# EAGLE design hat (EAGLE 7.5.0)
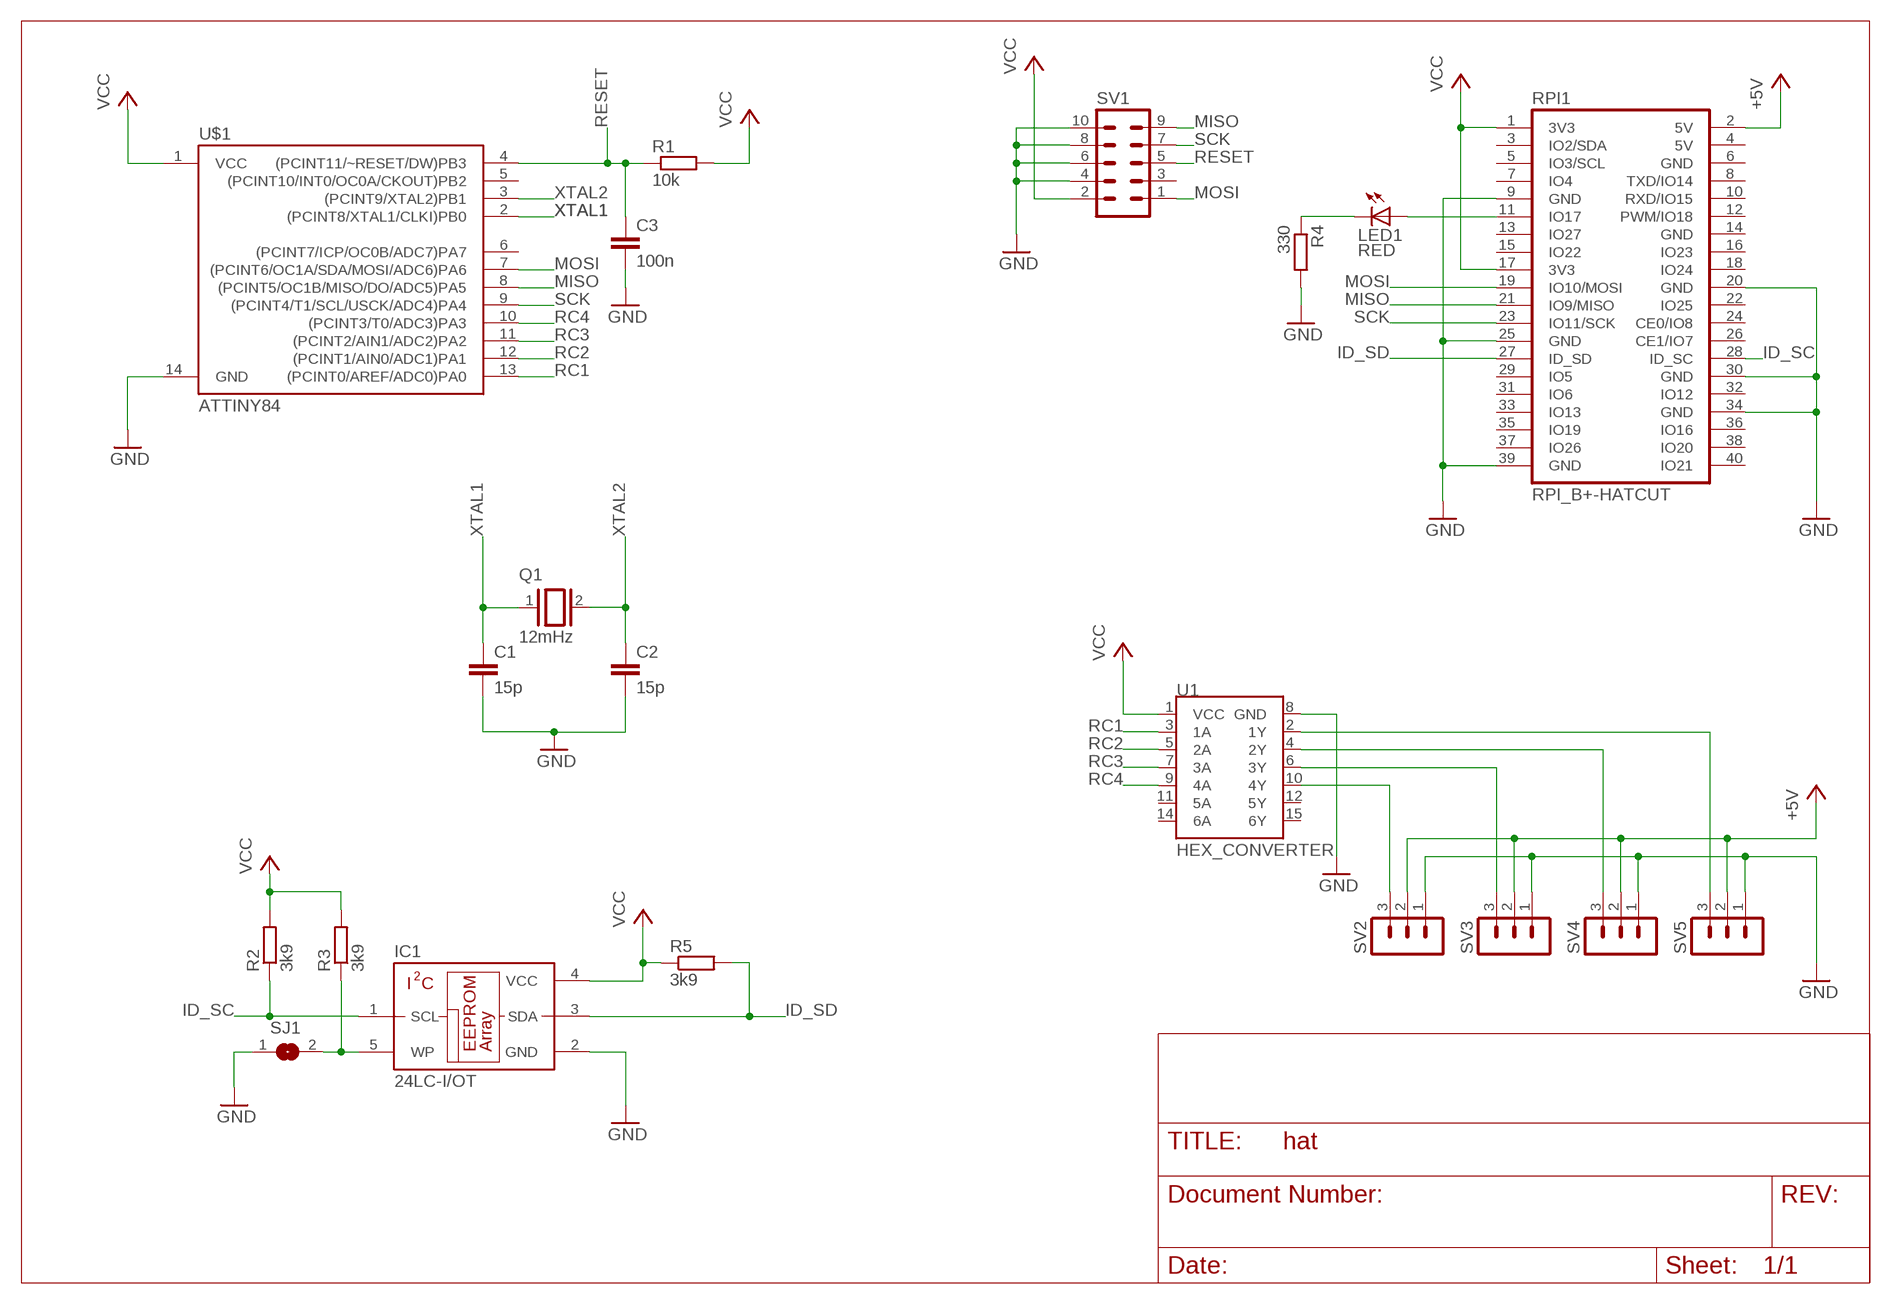
[diagram p0: schematic, sheet 1]

## Parts
C1  15p  C-EUC0603  [C0603]
C2  15p  C-EUC0603  [C0603]
C3  100n  C-EUC0603  [C0603]
IC1  24LC-I/OT  [SOT23-5]
LED1  RED  LEDCHIPLED_0805  [CHIPLED_0805]
Q1  12mHz  XTAL/S  [QS]
R1  10k  R-EU_R0805  [R0805]
R2  3k9  R-EU_R0805  [R0805]
R3  3k9  R-EU_R0805  [R0805]
R4  330  R-EU_R0805  [R0805]
R5  3k9  R-EU_R0805  [R0805]
RPI1  RPI_B+-HATCUT  [RPI-B+HAT_CUTOUT]
SJ1  SJ  [SJ]
SV1  MA05-2  [MA05-2]
SV2  MA03-1  [MA03-1]
SV3  MA03-1  [MA03-1]
SV4  MA03-1  [MA03-1]
SV5  MA03-1  [MA03-1]
U1  HEX_CONVERTER  [SO016]
U$1  ATTINY84  [SO14]

## Nets
+5V: RPI1.2(5V) SV2.2 SV3.2 SV4.2 SV5.2
GND: C1.2 C2.2 C3.2 IC1.2(GND) R4.2 RPI1.9(GND) RPI1.20(GND) RPI1.25(GND) RPI1.30(GND) RPI1.34(GND) RPI1.39(GND) SJ1.1 SV1.4 SV1.6 SV1.8 SV1.10 SV2.1 SV3.1 SV4.1 SV5.1 U1.8(GND) U$1.14(GND)
ID_SC: IC1.1(SCL) R2.1 RPI1.28(ID_SC)
ID_SD: IC1.3(SDA) R5.2 RPI1.27(ID_SD)
MISO: RPI1.21(IO9/MISO) SV1.9 U$1.8((PCINT5/OC1B/MISO/DO/ADC5)PA5)
MOSI: RPI1.19(IO10/MOSI) SV1.1 U$1.7((PCINT6/OC1A/SDA/MOSI/ADC6)PA6)
N$1: SV2.3 U1.10(4Y)
N$2: SV3.3 U1.6(3Y)
N$3: SV4.3 U1.4(2Y)
N$4: SV5.3 U1.2(1Y)
N$5: IC1.5(WP) R3.1 SJ1.2
N$7: LED1.A RPI1.11(IO17)
N$8: LED1.C R4.1
RC1: U1.3(1A) U$1.13((PCINT0/AREF/ADC0)PA0)
RC2: U1.5(2A) U$1.12((PCINT1/AIN0/ADC1)PA1)
RC3: U1.7(3A) U$1.11((PCINT2/AIN1/ADC2)PA2)
RC4: U1.9(4A) U$1.10((PCINT3/T0/ADC3)PA3)
RESET: C3.1 R1.1 SV1.5 U$1.4((PCINT11/~RESET/DW)PB3)
SCK: RPI1.23(IO11/SCK) SV1.7 U$1.9((PCINT4/T1/SCL/USCK/ADC4)PA4)
VCC: IC1.4(VCC) R1.2 R2.2 R3.2 R5.1 RPI1.1(3V3) RPI1.17(3V3) SV1.2 U1.1(VCC) U$1.1(VCC)
XTAL1: C1.1 Q1.1 U$1.2((PCINT8/XTAL1/CLKI)PB0)
XTAL2: C2.1 Q1.2 U$1.3((PCINT9/XTAL2)PB1)
Unconnected: RPI1.3(IO2/SDA) RPI1.4(5V) RPI1.5(IO3/SCL) RPI1.6(GND) RPI1.7(IO4) RPI1.8(TXD/IO14) RPI1.10(RXD/IO15) RPI1.12(PWM/IO18) RPI1.13(IO27) RPI1.14(GND) RPI1.15(IO22) RPI1.16(IO23) RPI1.18(IO24) RPI1.22(IO25) RPI1.24(CE0/IO8) RPI1.26(CE1/IO7) RPI1.29(IO5) RPI1.31(IO6) RPI1.32(IO12) RPI1.33(IO13) RPI1.35(IO19) RPI1.36(IO16) RPI1.37(IO26) RPI1.38(IO20) RPI1.40(IO21) SV1.3 U1.11(5A) U1.12(5Y) U1.14(6A) U1.15(6Y) U$1.5((PCINT10/INT0/OC0A/CKOUT)PB2) U$1.6((PCINT7/ICP/OC0B/ADC7)PA7)

## Library data of the parts
C1-C3 = rcl:C-EU: CAPACITOR, European symbol
IC1 = we-chip:24LC*: Microchip I2C EEPROM 2 Kbit - 24LC02B - 24LC02BT-I/OTDKR-ND 32 Kbit- 24LC32A - 24LC32AT-I/OTDKR-ND; DIGIKEY: 24LC32AT-I/OTDKR-ND
LED1 = led:LED: LED OSRAM: - CHIPLED LG R971, LG N971, LY N971, LG Q971, LY Q971, LO R971, LY R971 LH N974, LH R974 LS Q976, LO Q976, LY Q976 LO Q996 - Hyper CHIPLED LW Q18S LB Q993, LB Q99A, LB R99A - SideLED LS A670, LO A670, LY A670, LG A670, LP A670 LB A673, LV A673, LT A673, LW A673 LH A674 LY A675 LS A676, LA A676, LO A676, LY A676, LW A676 LS A679, LY A679, LG A679 - Hyper Micro SIDELED® LS Y876, LA Y876, LO Y876, LY Y876 LT Y87S - SmartLED LW L88C, LW L88S LB L89C, LB L89S, LG L890 LS L89K, LO L89K, LY L89K LS L896, LA L896, LO L896, LY L896 - TOPLED LS T670, LO T670, LY T670, LG T670, LP T670 LSG T670, LSP T670, LSY T670, LOP T670, LYG T670 LG T671, LOG T671, LSG T671 LB T673, LV T673, LT T673, LW T673 LH T674 LS T676, LA T676, LO T676, LY T676, LB T676, LH T676, LSB T676, LW T676 LB T67C, LV T67C, LT T67C, LS T67K, LO T67K, LY T67K, LW E67C LS E67B, LA E67B, LO E67B, LY E67B, LB E67C, LV E67C, LT E67C LW T67C LS T679, LY T679, LG T679 LS T770, LO T770, LY T770, LG T770, LP T770 LB T773, LV T773, LT T773, LW T773 LH T774 LS E675, LA E675, LY E675, LS T675 LS T776, LA T776, LO T776, LY T776, LB T776 LHGB T686 LT T68C, LB T68C - Hyper Mini TOPLED® LB M676 - Mini TOPLED Santana® LG M470 LS M47K, LO M47K, LY M47K Source: http://www.osram.convergy.de LUXEON: - LUMILED® LXK2-PW12-R00, LXK2-PW12-S00, LXK2-PW14-U00, LXK2-PW14-V00 LXK2-PM12-R00, LXK2-PM12-S00, LXK2-PM14-U00 LXK2-PE12-Q00, LXK2-PE12-R00, LXK2-PE12-S00, LXK2-PE14-T00, LXK2-PE14-U00 LXK2-PB12-K00, LXK2-PB12-L00, LXK2-PB12-M00, LXK2-PB14-N00, LXK2-PB14-P00, LXK2-PB14-Q00 LXK2-PR12-L00, LXK2-PR12-M00, LXK2-PR14-Q00, LXK2-PR14-R00 LXK2-PD12-Q00, LXK2-PD12-R00, LXK2-PD12-S00 LXK2-PH12-R00, LXK2-PH12-S00 LXK2-PL12-P00, LXK2-PL12-Q00, LXK2-PL12-R00 Source: www.luxeon.com KINGBRIGHT: KA-3528ASYC Source: www.kingbright.com
Q1 = special:XTAL/S: CRYSTAL
R1-R3 R5 = resistor:R-EU_: RESISTOR, European symbol
R4 = rcl:R-EU_: RESISTOR, European symbol
RPI1 = we-board:RPI_B+: Raspberry Pi Model B+
SJ1 = jumper:SJ: SMD solder JUMPER
SV1 = con-lstb:MA05-2: PIN HEADER; OC_FARNELL: unknown; OC_NEWARK: unknown
SV2-SV5 = con-lstb:MA03-1: PIN HEADER; OC_FARNELL: unknown; OC_NEWARK: unknown
U1 = SparkFun-DigitalIC:HEX_CONVERTER: 74HC4050 Hex Buffer Level Shifter SMD SO016; PROD_ID: IC-09604
U$1 = SparkFun-DigitalIC:ATTINY84: Atmel 14-pin 2/4/8kB flash uC; PROD_ID: IC-11285

## Board
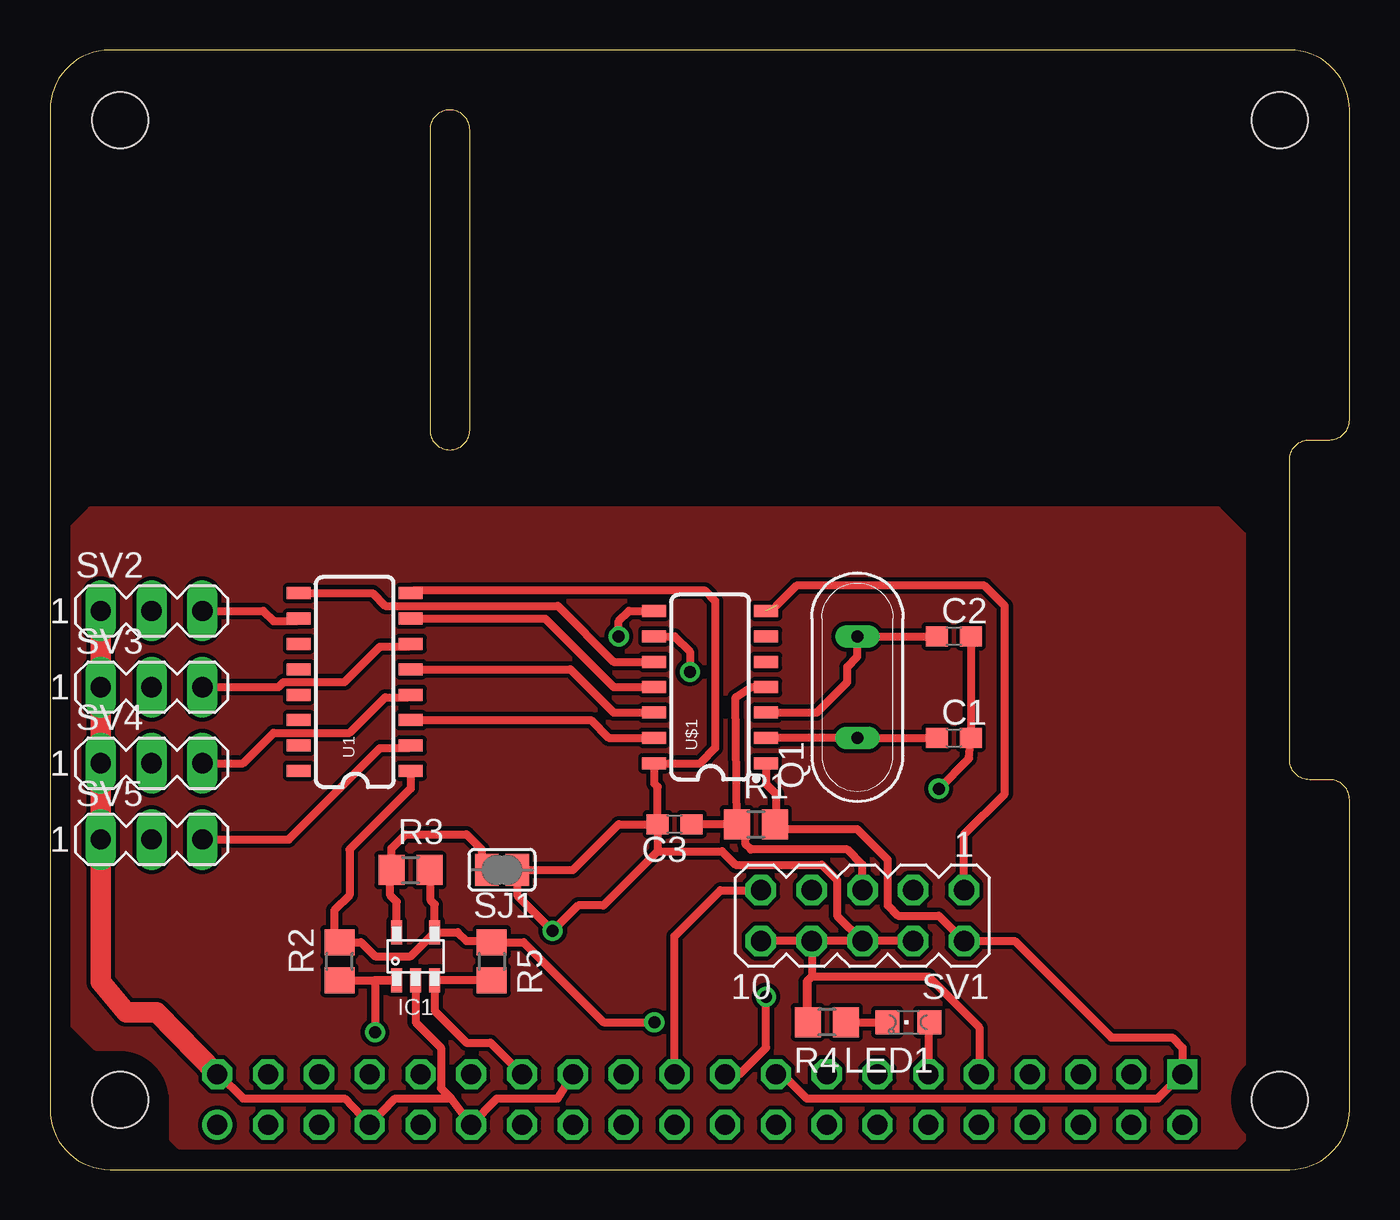
[diagram p1: board, top side]
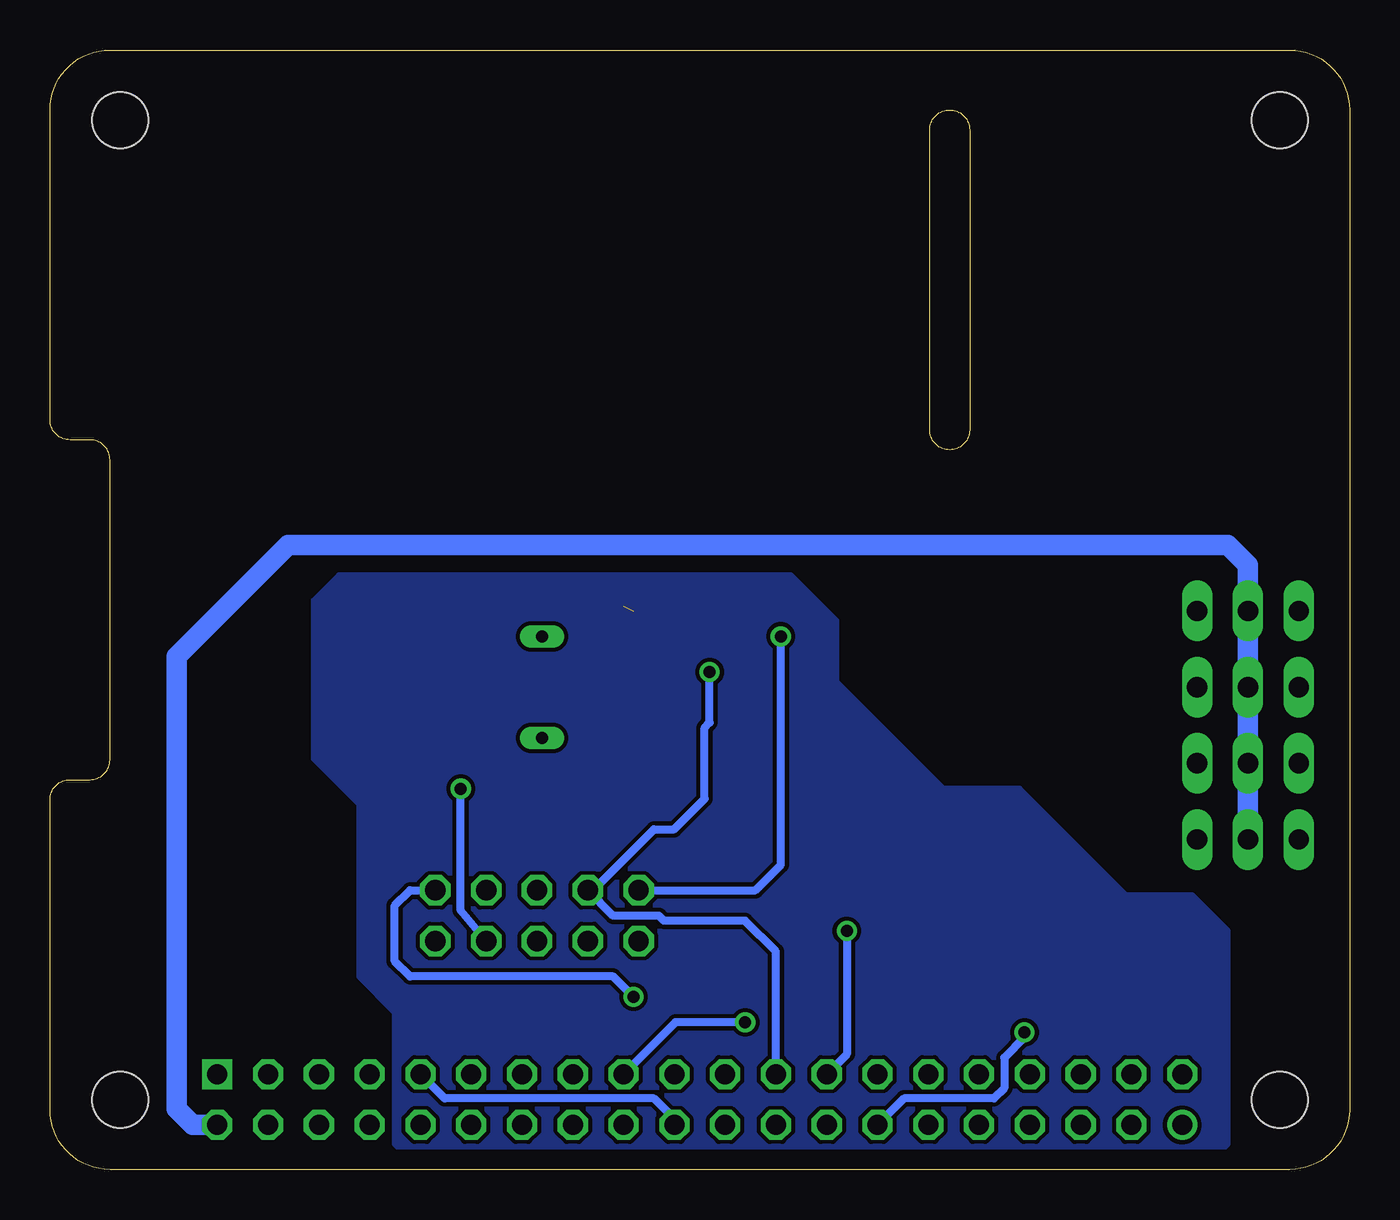
[diagram p2: board, bottom side, seen from below]

Size 65 x 56 mm. Coordinates in mm from the lower left corner, seen from the top.
Copper layers (1*16): Top 0.035mm / dielectric 1.5mm / Bottom 0.035mm
Design rules "default": minimum track width 10mil, minimum drill 24mil, track to track 8mil, track to pad 8mil, pad to pad 8mil, via to via 8mil, smd to smd 8mil, copper to edge 40mil, drill to drill 8mil, minimum pad ring 10mil, minimum via ring 8mil, stop-mask expansion 4mil, vias tented up to drill 0mil, thermal gap 10mil

### Footprints (pad centres in the part's own frame; a part is rotated, then mirrored left to right if it is on the bottom)
C0603 = smd 1.1 x 1: 1 -0.85,0; 2 0.85,0
SOT23-5 = smd 1.2 x 0.6: 1 -1.2,0.95; 2 -1.2,0; 3 -1.2,-0.95; 4 1.2,-0.95; 5 1.2,0.95
CHIPLED_0805 = smd 1.2 x 1.2: A 0,-1.05; C 0,1.05
QS = drill 0.61 long: 1 -2.54,0; 2 2.54,0
R0805 = smd 1.3 x 1.5: 1 -0.95,0; 2 0.95,0
RPI-B+HAT_CUTOUT = drill 1 square: 1 56.63,4.77 | drill 1 octagon: 2 56.63,2.23; 3 54.09,4.77; 4 54.09,2.23; 5 51.55,4.77; 6 51.55,2.23; 7 49.01,4.77; 8 49.01,2.23; 9 46.47,4.77; 10 46.47,2.23; 11 43.93,4.77; 12 43.93,2.23; 13 41.39,4.77; 14 41.39,2.23; 15 38.85,4.77; 16 38.85,2.23; 17 36.31,4.77; 18 36.31,2.23; 19 33.77,4.77; 20 33.77,2.23; 21 31.23,4.77; 22 31.23,2.23; 23 28.69,4.77; 24 28.69,2.23; 25 26.15,4.77; 26 26.15,2.23; 27 23.61,4.77; 28 23.61,2.23; 29 21.07,4.77; 30 21.07,2.23; 31 18.53,4.77; 32 18.53,2.23; 33 15.99,4.77; 34 15.99,2.23; 35 13.45,4.77; 36 13.45,2.23; 37 10.91,4.77; 38 10.91,2.23; 39 8.37,4.77 | drill 1: 40 8.37,2.23 | hole 2.8: 3.5,3.5; 3.5,52.5; 61.5,52.5; 61.5,3.5
SJ = smd 1.168 x 1.6: 1 -0.762,0; 2 0.762,0
MA05-2 = drill 1.016 octagon: 1 -5.08,-1.27; 2 -5.08,1.27; 3 -2.54,-1.27; 4 -2.54,1.27; 5 0,-1.27; 6 0,1.27; 7 2.54,-1.27; 8 2.54,1.27; 9 5.08,-1.27; 10 5.08,1.27
MA03-1 = drill 1.016 long: 1 -2.54,0; 2 0,0; 3 2.54,0
SO016 = smd 0.6 x 1.2: 1 -4.445,-2.8; 2 -3.175,-2.8; 3 -1.905,-2.8; 4 -0.635,-2.8; 5 0.635,-2.8; 6 1.905,-2.8; 7 3.175,-2.8; 8 4.445,-2.8; 9 4.445,2.8; 10 3.175,2.8; 11 1.905,2.8; 12 0.635,2.8; 13 -0.635,2.8; 14 -1.905,2.8; 15 -3.175,2.8; 16 -4.445,2.8
SO14 = smd 0.6 x 1.2: 1 -3.81,-2.8; 2 -2.54,-2.8; 3 -1.27,-2.8; 4 0,-2.8; 5 1.27,-2.8; 6 2.54,-2.8; 7 3.81,-2.8; 8 3.81,2.8; 9 2.54,2.8; 10 1.27,2.8; 11 0,2.8; 12 -1.27,2.8; 13 -2.54,2.8; 14 -3.81,2.8

### Placement (x,y rotation side)
C1  45.21,21.59 0 top
C2  45.21,26.67 0 top
C3  31.24,17.27 180 top
IC1  18.29,10.67 90 top
LED1  42.93,7.37 90 top
Q1  40.39,24.13 90 top
R1  35.31,17.27 0 top
R2  14.48,10.41 90 top
R3  18.03,14.99 0 top
R4  38.86,7.37 180 top
R5  22.1,10.41 270 top
RPI1  0,0 0 top
SJ1  22.61,14.99 180 top
SV1  40.64,12.7 180 top
SV2  5.08,27.94 0 top
SV3  5.08,24.13 0 top
SV4  5.08,20.32 0 top
SV5  5.08,16.51 0 top
U1  15.24,24.38 90 top
U$1  33.02,24.13 90 top

### Tracks (layer width: path | path; a pad name or v marks a point on that pad's centre or on a via)
+5V
  Bottom 1.016: SV5.2 SV4.2 SV3.2 SV2.2 5.08,30.23 6.1,31.24 53.09,31.24 58.67,25.65 58.67,3.05 57.86,2.23 RPI1.2
GND  (via drill 0.6)
  Top 0.406: RPI1.39 8.44,4.77 9.65,3.56 14.73,3.56 RPI1.34 17.27,3.56 20.07,3.56 | 20.07,3.56 RPI1.30 22.35,3.56 25.4,3.56 RPI1.25 | C2.2 C1.2 45.97,20.57 v44.45,19.05 | SV1.4 SV1.6 | SV1.6 SV1.8 | SV1.8 SV1.10 | U1.8 18.17,28.96 32.77,28.96 33.27,28.45 33.27,21.08 32.51,20.32 U$1.14 30.23,19.3 30.39,19.14 C3.2 | IC1.2 18.29,7.37 19.56,6.1 19.56,4.06 20.07,3.56 | C3.2 28.45,17.27 26.16,14.99 SJ1.1 23.37,13.72 v25.15,11.94 26.42,13.21 27.69,13.21 30.39,15.91 | C3.2 30.39,15.91 | SV1.8 38.1,9.65 | 37.91,9.46 37.85,9.4 37.85,7.43 R4.2 37.91,9.46 | 30.39,15.91 33.62,15.91 34.29,15.24 38.61,15.24 39.37,14.48 39.37,12.7 SV1.6 | 37.91,9.46 38.1,9.65 | 38.1,9.65 43.94,9.65 46.48,7.11 46.48,4.78 RPI1.9
  Top 1.016: RPI1.39 5.33,7.87 3.81,7.87 2.54,9.4 SV5.1 SV4.1 SV3.1 SV2.1
  Bottom 0.406: SV1.4 44.45,12.95 v44.45,19.05 | v25.15,11.94 25.15,5.77 RPI1.25 | RPI1.20 33.77,2.53 34.8,3.56 45.26,3.56 RPI1.9
ID_SC  (via drill 0.6)
  Top 0.406: R2.1 IC1.1 16.26,9.47 v16.26,6.86
  Bottom 0.406: v16.26,6.86 16.26,6.6 17.27,5.59 17.27,4.06 17.78,3.56 22.28,3.56 RPI1.28
ID_SD
  Top 0.406: R5.2 IC1.3 19.24,7.94 20.83,6.35 22.03,6.35 RPI1.27
MISO  (via drill 0.6)
  Top 0.406: v28.45,26.67 28.45,27.43 28.96,27.94 U$1.8 | RPI1.21 31.23,11.67 33.53,13.97 SV1.9
  Bottom 0.406: SV1.9 29.72,13.97 28.45,15.24 v28.45,26.67
MOSI  (via drill 0.6)  (1 unrouted)
  Top 0.406: SV1.1 45.72,16.76 47.75,18.8 47.75,28.19 46.74,29.21 37.34,29.21 36.32,28.19 | RPI1.19 34.49,4.77 35.81,6.1 v35.81,8.64
  Bottom 0.406: v35.81,8.64 36.83,9.65 46.99,9.65 47.75,10.41 47.75,13.21 46.99,13.97 SV1.1
N$1
  Top 0.406: SV2.3 10.67,27.94 11.18,27.43 12.31,27.43 U1.10
N$2
  Top 0.406: SV3.3 11.43,24.13 11.68,24.38 14.73,24.38 16.51,26.16 17.91,26.16 U1.6
N$3
  Top 0.406: SV4.3 9.65,20.32 11.18,21.84 14.99,21.84 16.76,23.62 17.91,23.62 U1.4
N$4
  Top 0.406: SV5.3 11.94,16.51 16.51,21.08 17.91,21.08 U1.2
N$5
  Top 0.406: IC1.5 17.34,13.4 17.02,13.72 17.02,14.92 R3.1 17.08,16.07 17.78,16.76 20.83,16.76 21.59,16 21.59,15.24 SJ1.2
N$6
  pour Top: 0.76,10.41 0.76,7.62 2.29,6.1 3.81,6.1 6.1,3.81 6.1,1.52 6.86,0.76 7.87,0.76 58.93,0.76 59.69,1.52 59.69,3.3 59.69,31.75 58.42,33.02 53.85,33.02 2.03,33.02 0.76,31.75
N$7
  Top 0.406: RPI1.11 LED1.A
N$8
  Top 0.406: R4.1 LED1.C
N$9
  pour Bottom: 12.45,0.76 6.6,0.76 6.1,1.27 6.1,11.94 7.87,13.72 11.18,13.72 16.51,19.05 20.32,19.05 25.65,24.38 25.65,27.43 27.94,29.72 28.96,29.72 50.55,29.72 51.82,28.45 51.82,20.57 49.53,18.29 49.53,9.65 47.75,7.87 47.75,5.84 47.75,1.27 47.24,0.76 46.74,0.76
RC1
  Top 0.406: U1.3 27.05,22.48 27.94,21.59 U$1.13
RC2
  Top 0.406: U1.5 26.03,25.02 28.19,22.86 U$1.12
RC3
  Top 0.406: U1.7 24.77,27.56 28.19,24.13 U$1.11
RC4
  Top 0.406: U1.9 16.13,28.83 16.76,28.19 25.4,28.19 28.19,25.4 U$1.10
RESET
  Top 0.406: R1.1 C3.1 | R1.1 34.29,23.62 35.05,24.13 U$1.4 | SV1.5 40.64,15.24 39.88,16 35.05,16 34.8,16.26 34.8,16.83 R1.1
SCK  (via drill 0.6)
  Top 0.406: U$1.9 31.24,26.67 32,25.91 v32,24.89
  Bottom 0.406: RPI1.23 28.69,10.91 30.23,12.45 34.29,12.45 34.54,12.7 36.83,12.7 SV1.7 37.85,13.97 34.8,17.02 33.78,17.02 32.26,18.54 32.26,22.1 32,22.35 v32,24.89
VCC  (via drill 0.6)
  Top 0.406: IC1.4 20.39,11.87 20.83,11.43 22.03,11.43 R5.1 23.69,11.36 27.69,7.37 v30.23,7.37 | IC1.4 19.24,13.27 19.05,13.46 19.05,14.92 R3.2 | U1.1 18.04,19.06 14.99,16 14.99,13.72 14.22,12.95 14.22,11.62 R2.2 15.56,11.36 16.26,10.67 18.04,10.67 IC1.4 | U$1.1 35.82,19.3 36.32,18.8 36.32,17.34 R1.2 36.58,17.27 36.83,17.02 40.39,17.02 41.91,15.49 41.91,13.21 42.42,12.7 44.45,12.7 SV1.2 48.26,11.43 53.09,6.6 56.13,6.6 56.64,6.1 56.64,4.78 RPI1.1 55.42,3.56 37.85,3.56 36.63,4.77 RPI1.17
  Bottom 0.406: v30.23,7.37 33.71,7.37 RPI1.17
XTAL1
  Top 0.406: C1.1 Q1.1 U$1.2
XTAL2
  Top 0.406: C2.1 Q1.2 40.39,25.65 39.88,25.15 39.88,24.38 38.35,22.86 U$1.3